# EAGLE design gameboyzero-split-top (EAGLE 8.5.0)
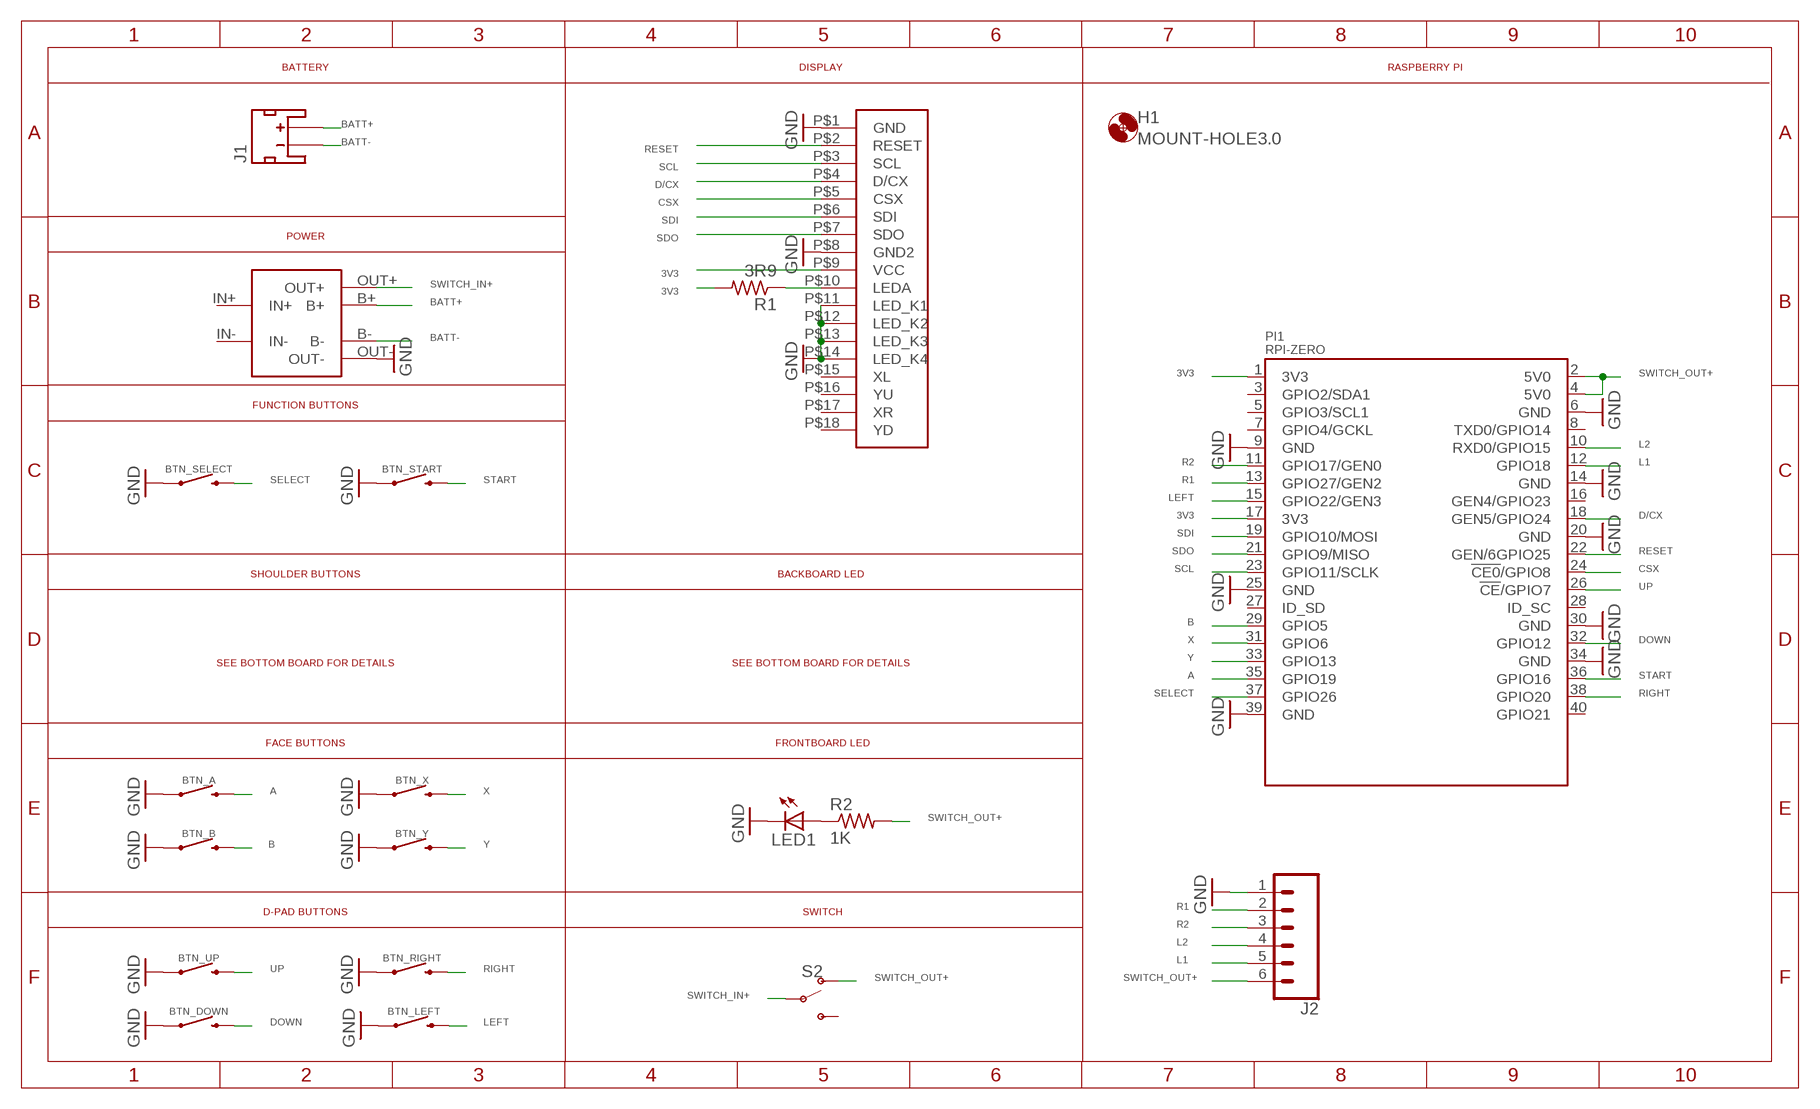
[diagram p0: schematic, sheet 1]

## Parts
BTN_A  MOMENTARY-SWITCH-SPST-SMD-12MM  [TACTILE_SWITCH_SMD_12MM]
BTN_B  MOMENTARY-SWITCH-SPST-SMD-12MM  [TACTILE_SWITCH_SMD_12MM]
BTN_DOWN  MOMENTARY-SWITCH-SPST-SMD-6.2MM-TALL  [TACTILE_SWITCH_SMD_6.2MM_TALL]
BTN_LEFT  MOMENTARY-SWITCH-SPST-SMD-6.2MM-TALL  [TACTILE_SWITCH_SMD_6.2MM_TALL]
BTN_RIGHT  MOMENTARY-SWITCH-SPST-SMD-6.2MM-TALL  [TACTILE_SWITCH_SMD_6.2MM_TALL]
BTN_SELECT  MOMENTARY-SWITCH-SPST-SMD-6.0X3.5MM  [TACTILE_SWITCH_SMD_6.0X3.5MM]
BTN_START  MOMENTARY-SWITCH-SPST-SMD-6.0X3.5MM  [TACTILE_SWITCH_SMD_6.0X3.5MM]
BTN_UP  MOMENTARY-SWITCH-SPST-SMD-6.2MM-TALL  [TACTILE_SWITCH_SMD_6.2MM_TALL]
BTN_X  MOMENTARY-SWITCH-SPST-SMD-12MM  [TACTILE_SWITCH_SMD_12MM]
BTN_Y  MOMENTARY-SWITCH-SPST-SMD-12MM  [TACTILE_SWITCH_SMD_12MM]
H1  MOUNT-HOLE3.0  [3,0]
J1  JST_2MM_MALE  [JST-2-SMD]
J2  CONN_06SILK_FEMALE_PTH  [1X06]
LED1  LEDCHIPLED_0805  [CHIPLED_0805]
PI1  RPI-ZERO  [RASPBERRYPI_BASTELSTUBE_V13_RASPI_BOARD_B+_FULL]
POWER1  03962A  [03962A]
R1  3R9  R-US_R0805  [R0805]
R2  1K  R-US_R0805  [R0805]
S2  SWITCH-SPDT-SMD-RIGHT-ANGLE  [SWITCH_SPST_SMD_A]
SCREEN1  GAMEBOYZEROHANDHELDDISPLAYS-2.8  [GAMEBOYZEROHANDHELDDISPLAYS-2.8]

## Nets
3V3: PI1.1(3V3) PI1.17(3V3) R1.2 SCREEN1.P$9(VCC)
3V3100OHM: R1.1 SCREEN1.P$10(LEDA)
A: BTN_A.3 PI1.35(GPIO19)
B: BTN_B.3 PI1.29(GPIO5)
BATT+: J1.2(+) POWER1.B+
BATT-: J1.1(-) POWER1.B-
CSX: PI1.24(!CE0!/GPIO8) SCREEN1.P$5(CSX)
D/CX: PI1.18(GEN5/GPIO24) SCREEN1.P$4(D/CX)
DOWN: BTN_DOWN.B2 PI1.32(GPIO12)
GND: BTN_A.1 BTN_B.1 BTN_DOWN.A2 BTN_LEFT.A2 BTN_RIGHT.A2 BTN_SELECT.1 BTN_START.1 BTN_UP.A2 BTN_X.1 BTN_Y.1 J2.1 LED1.C PI1.6(GND) PI1.9(GND) PI1.14(GND) PI1.20(GND) PI1.25(GND) PI1.30(GND) PI1.34(GND) PI1.39(GND) POWER1.OUT- SCREEN1.P$1(GND) SCREEN1.P$8(GND2) SCREEN1.P$11(LED_K1) SCREEN1.P$12(LED_K2) SCREEN1.P$13(LED_K3) SCREEN1.P$14(LED_K4)
L1: J2.5 PI1.12(GPIO18)
L2: J2.4 PI1.10(RXD0/GPIO15)
LED: LED1.A R2.1
LEFT: BTN_LEFT.B2 PI1.15(GPIO22/GEN3)
R1: J2.2 PI1.13(GPIO27/GEN2)
R2: J2.3 PI1.11(GPIO17/GEN0)
RESET: PI1.22(GEN/6GPIO25) SCREEN1.P$2(RESET)
RIGHT: BTN_RIGHT.B2 PI1.38(GPIO20)
SCL: PI1.23(GPIO11/SCLK) SCREEN1.P$3(SCL)
SDI: PI1.19(GPIO10/MOSI) SCREEN1.P$6(SDI)
SDO: PI1.21(GPIO9/MISO) SCREEN1.P$7(SDO)
SELECT: BTN_SELECT.2 PI1.37(GPIO26)
START: BTN_START.2 PI1.36(GPIO16)
SWITCH_IN+: POWER1.OUT+ S2.2(P)
SWITCH_OUT+: J2.6 PI1.2(5V0) PI1.4(5V0) R2.2 S2.1(O)
UP: BTN_UP.B2 PI1.26(!CE!/GPIO7)
X: BTN_X.3 PI1.31(GPIO6)
Y: BTN_Y.3 PI1.33(GPIO13)
Unconnected: J1.NC1(PAD1) J1.NC2(PAD2) PI1.3(GPIO2/SDA1) PI1.5(GPIO3/SCL1) PI1.7(GPIO4/GCKL) PI1.8(TXD0/GPIO14) PI1.16(GEN4/GPIO23) PI1.27(ID_SD) PI1.28(ID_SC) PI1.40(GPIO21) POWER1.IN+ POWER1.IN- S2.3(S) SCREEN1.P$15(XL) SCREEN1.P$16(YU) SCREEN1.P$17(XR) SCREEN1.P$18(YD)

## Notes on the sheet
- BATTERY | DISPLAY | RASPBERRY PI
- POWER
- FUNCTION BUTTONS
- SHOULDER BUTTONS | BACKBOARD LED
- SEE BOTTOM BOARD FOR DETAILS | SEE BOTTOM BOARD FOR DETAILS
- FACE BUTTONS | FRONTBOARD LED
- D-PAD BUTTONS | SWITCH

## Library data of the parts
BTN_A BTN_B BTN_X BTN_Y = SparkFun-Switches:MOMENTARY-SWITCH-SPST: Momentary Switch (Pushbutton) - SPST Normally-open (NO) SPST momentary switches (buttons, pushbuttons). Variants PTH-12MM - 12mm square, through-hole Momentary Pushbutton Switch - 12mm Square <https://www.sparkfun.com/products/9190> (COM-09190) PTH-6.0MM, PTH-6.0MM-KIT - 6.0mm square, through-hole Mini Pushbutton Switch <https://www.sparkfun.com/products/97> (COM-00097) KIT package intended for soldering kit's - only one side of pads' copper is exposed. PTH-RIGHT-ANGLE-KIT - Right-angle, through-hole Right Angle Tactile Button <https://www.sparkfun.com/products/10791> - Used on SparkFun BigTime Watch Kit <https://www.sparkfun.com/products/11734> SMD-12MM - 12mm square, surface-mount Tactile Button - SMD (12mm) <https://www.sparkfun.com/products/12993> (COM-12993) Used on SparkFun PicoBoard <https://www.sparkfun.com/products/11888> SMD-4.5MM - 4.5mm Square Trackball Switch Used on SparkFun Blackberry Trackballer Breakout <https://www.sparkfun.com/products/13169> SMD-4.6MMX2.8MM - 4.60mm x 2.80mm, surface mount Used on SparkFun SAMD21 Mini Breakout <https://www.sparkfun.com/products/13664> SMD-5.2MM, SMD-5.2-REDUNDANT - 5.2mm square, surface-mount Mini Pushbutton Switch - SMD <https://www.sparkfun.com/products/8720> (COM-08720) Used on Arduino Pro Mini <https://www.sparkfun.com/products/11114> REDUNDANT package connects both switch circuits together SMD-6.0X3.5MM - 6.0 x 3.5mm, surface mount Momentary Reset Switch SMD <https://www.sparkfun.com/products/8229> (COM-08229) SMD-6.2MM-TALL - 6.2mm square, surface mount Tactile Button - SMD (6mm) <https://www.sparkfun.com/products/12992> Used on SparkFun Digital Sandbox <https://www.sparkfun.com/products/12651> SMD-RIGHT-ANGLE - Right-angle, surface mount Used on SparkFun Block for Intel® Edison - Arduino <https://www.sparkfun.com/products/13036>; PROD_ID: SWCH-11967; SF_SKU: COM-12993
BTN_DOWN BTN_LEFT BTN_RIGHT BTN_UP = SparkFun-Switches:MOMENTARY-SWITCH-SPST: Momentary Switch (Pushbutton) - SPST Normally-open (NO) SPST momentary switches (buttons, pushbuttons). Variants PTH-12MM - 12mm square, through-hole Momentary Pushbutton Switch - 12mm Square <https://www.sparkfun.com/products/9190> (COM-09190) PTH-6.0MM, PTH-6.0MM-KIT - 6.0mm square, through-hole Mini Pushbutton Switch <https://www.sparkfun.com/products/97> (COM-00097) KIT package intended for soldering kit's - only one side of pads' copper is exposed. PTH-RIGHT-ANGLE-KIT - Right-angle, through-hole Right Angle Tactile Button <https://www.sparkfun.com/products/10791> - Used on SparkFun BigTime Watch Kit <https://www.sparkfun.com/products/11734> SMD-12MM - 12mm square, surface-mount Tactile Button - SMD (12mm) <https://www.sparkfun.com/products/12993> (COM-12993) Used on SparkFun PicoBoard <https://www.sparkfun.com/products/11888> SMD-4.5MM - 4.5mm Square Trackball Switch Used on SparkFun Blackberry Trackballer Breakout <https://www.sparkfun.com/products/13169> SMD-4.6MMX2.8MM - 4.60mm x 2.80mm, surface mount Used on SparkFun SAMD21 Mini Breakout <https://www.sparkfun.com/products/13664> SMD-5.2MM, SMD-5.2-REDUNDANT - 5.2mm square, surface-mount Mini Pushbutton Switch - SMD <https://www.sparkfun.com/products/8720> (COM-08720) Used on Arduino Pro Mini <https://www.sparkfun.com/products/11114> REDUNDANT package connects both switch circuits together SMD-6.0X3.5MM - 6.0 x 3.5mm, surface mount Momentary Reset Switch SMD <https://www.sparkfun.com/products/8229> (COM-08229) SMD-6.2MM-TALL - 6.2mm square, surface mount Tactile Button - SMD (6mm) <https://www.sparkfun.com/products/12992> Used on SparkFun Digital Sandbox <https://www.sparkfun.com/products/12651> SMD-RIGHT-ANGLE - Right-angle, surface mount Used on SparkFun Block for Intel® Edison - Arduino <https://www.sparkfun.com/products/13036>; PROD_ID: SWCH-11966; SF_SKU: COM-12992
BTN_SELECT BTN_START = SparkFun-Switches:MOMENTARY-SWITCH-SPST: Momentary Switch (Pushbutton) - SPST Normally-open (NO) SPST momentary switches (buttons, pushbuttons). Variants PTH-12MM - 12mm square, through-hole Momentary Pushbutton Switch - 12mm Square <https://www.sparkfun.com/products/9190> (COM-09190) PTH-6.0MM, PTH-6.0MM-KIT - 6.0mm square, through-hole Mini Pushbutton Switch <https://www.sparkfun.com/products/97> (COM-00097) KIT package intended for soldering kit's - only one side of pads' copper is exposed. PTH-RIGHT-ANGLE-KIT - Right-angle, through-hole Right Angle Tactile Button <https://www.sparkfun.com/products/10791> - Used on SparkFun BigTime Watch Kit <https://www.sparkfun.com/products/11734> SMD-12MM - 12mm square, surface-mount Tactile Button - SMD (12mm) <https://www.sparkfun.com/products/12993> (COM-12993) Used on SparkFun PicoBoard <https://www.sparkfun.com/products/11888> SMD-4.5MM - 4.5mm Square Trackball Switch Used on SparkFun Blackberry Trackballer Breakout <https://www.sparkfun.com/products/13169> SMD-4.6MMX2.8MM - 4.60mm x 2.80mm, surface mount Used on SparkFun SAMD21 Mini Breakout <https://www.sparkfun.com/products/13664> SMD-5.2MM, SMD-5.2-REDUNDANT - 5.2mm square, surface-mount Mini Pushbutton Switch - SMD <https://www.sparkfun.com/products/8720> (COM-08720) Used on Arduino Pro Mini <https://www.sparkfun.com/products/11114> REDUNDANT package connects both switch circuits together SMD-6.0X3.5MM - 6.0 x 3.5mm, surface mount Momentary Reset Switch SMD <https://www.sparkfun.com/products/8229> (COM-08229) SMD-6.2MM-TALL - 6.2mm square, surface mount Tactile Button - SMD (6mm) <https://www.sparkfun.com/products/12992> Used on SparkFun Digital Sandbox <https://www.sparkfun.com/products/12651> SMD-RIGHT-ANGLE - Right-angle, surface mount Used on SparkFun Block for Intel® Edison - Arduino <https://www.sparkfun.com/products/13036>; PROD_ID: SWCH-00815; SF_SKU: COM-08229
H1 = holes:MOUNT-HOLE: MOUNTING HOLE with drill center marker
J1 = SparkFun-Connectors:JST_2MM_MALE: JST 2MM MALE RA CONNECTOR Two pin, compact surface mount connector. Commonly used as a battery input connection point. We really like the solid locking feeling and high current rating on these small connectors. We use these all the time as battery connectors. Mates to single-cell LiPo batteries. Here is the connector we sell at SparkFun: JST Right Angle Connector - White <https://www.sparkfun.com/products/8612> (PRT-08612) Datasheet <http://www.sparkfun.com/datasheets/Prototyping/Connectors/JST-Horizontal.pdf> It was used on these SparkFun products: SparkFun MOSFET Power Controller <https://www.sparkfun.com/products/11214> (PRT-11214) SparkFun Battery Babysitter - LiPo Battery Manager <https://www.sparkfun.com/products/13777> (PRT-13777) And many, many others that required a lipo battery connection.; PROD_ID: CONN-11443; SF_ID: PRT-08612
J2 = SparkFun-Connectors:CONN_06: Multi connection point. Often used as Generic Header-pin footprint for 0.1 inch spaced/style header connections On any of the 0.1 inch spaced packages, you can populate with these: Break Away Headers - Straight <https://www.sparkfun.com/products/116> (PRT-00116) Break Away Male Headers - Right Angle <https://www.sparkfun.com/products/553> (PRT-00553) Female Headers <https://www.sparkfun.com/products/115> (PRT-00115) Break Away Headers - Machine Pin <https://www.sparkfun.com/products/117> (PRT-00117) Break Away Female Headers - Swiss Machine Pin <https://www.sparkfun.com/products/743> (PRT-00743) Arduino Stackable Header - 6 Pin <https://www.sparkfun.com/products/9280> (PRT-09280) For SCREWTERMINALS and SPRING TERMINALS visit here: Screw Terimnals on SparkFun.com <https://www.sparkfun.com/search/results?term=Screw+Terminals> (5mm/3.5mm/2.54mm spacing) This device is also useful as a general connection point to wire up your design to another part of your project. Our various solder wires solder well into these plated through hole pads. Hook-Up Wire - Assortment (Stranded, 22 AWG) <https://www.sparkfun.com/products/11375> (PRT-11375) Hook-Up Wire - Assortment (Solid Core, 22 AWG) <https://www.sparkfun.com/products/11367> (PRT-11367) View the entire wire category on our website here <https://www.sparkfun.com/categories/141>; PROD_ID: CONN-08437
LED1 = adafruit:LED: LED OSRAM: - CHIPLED LG R971, LG N971, LY N971, LG Q971, LY Q971, LO R971, LY R971 LH N974, LH R974 LS Q976, LO Q976, LY Q976 LO Q996 - Hyper CHIPLED LW Q18S LB Q993, LB Q99A, LB R99A - SideLED LS A670, LO A670, LY A670, LG A670, LP A670 LB A673, LV A673, LT A673, LW A673 LH A674 LY A675 LS A676, LA A676, LO A676, LY A676, LW A676 LS A679, LY A679, LG A679 - Hyper Micro SIDELED® LS Y876, LA Y876, LO Y876, LY Y876 LT Y87S - SmartLED LW L88C, LW L88S LB L89C, LB L89S, LG L890 LS L89K, LO L89K, LY L89K LS L896, LA L896, LO L896, LY L896 - TOPLED LS T670, LO T670, LY T670, LG T670, LP T670 LSG T670, LSP T670, LSY T670, LOP T670, LYG T670 LG T671, LOG T671, LSG T671 LB T673, LV T673, LT T673, LW T673 LH T674 LS T676, LA T676, LO T676, LY T676, LB T676, LH T676, LSB T676, LW T676 LB T67C, LV T67C, LT T67C, LS T67K, LO T67K, LY T67K, LW E67C LS E67B, LA E67B, LO E67B, LY E67B, LB E67C, LV E67C, LT E67C LW T67C LS T679, LY T679, LG T679 LS T770, LO T770, LY T770, LG T770, LP T770 LB T773, LV T773, LT T773, LW T773 LH T774 LS E675, LA E675, LY E675, LS T675 LS T776, LA T776, LO T776, LY T776, LB T776 LHGB T686 LT T68C, LB T68C - Hyper Mini TOPLED® LB M676 - Mini TOPLED Santana® LG M470 LS M47K, LO M47K, LY M47K Source: http://www.osram.convergy.de/
PI1 = RPI-Zero:RPI-ZERO
POWER1 = 03962A:03962A
R1 R2 = adafruit:R-US_: RESISTOR, American symbol
S2 = SparkFun-Switches:SWITCH-SPDT: Single Pole, Double Throw (SPDT) Switch Single-pole, double-throw (SPDT) switch. Variant Overview SMD-AYZ0202 Surface Mount DPDT Switch <https://www.sparkfun.com/products/597> (COM-00597) Used on e.g. LilyPad Arduino USB - ATmega32U4 Board <https://www.sparkfun.com/products/12049> PTH-11.6X4.0MM SPDT Mini Power Switch <https://www.sparkfun.com/products/102> (COM-00102) Used on e.g. SparkFun Simon Says - Through-Hole Soldering Kit <https://www.sparkfun.com/products/10547> (KIT-10547) PTH-11.6X4.0MM-KIT KIT version of SPDT Mini Power Switch - Simplifies soldering by removing tStop of switch pins - only one side can be soldered. PTH-11.6X4.0MM-LOCK LOCK version of SPDT Mini Power Switch - Offset pins hold switch in place for easier soldering. SMD-RIGHT-ANGLE Surface Mount Right Angle Switch <https://www.sparkfun.com/products/10860> (COM-10860) Used on e.g. SparkFun ESP8266 Thing <https://www.sparkfun.com/products/13231>; PROD_ID: SWCH-10651; SF_SKU: COM-10860
SCREEN1 = GameboyZeroHandheldDisplays:GAMEBOYZEROHANDHELDDISPLAYS-2.8

## Board
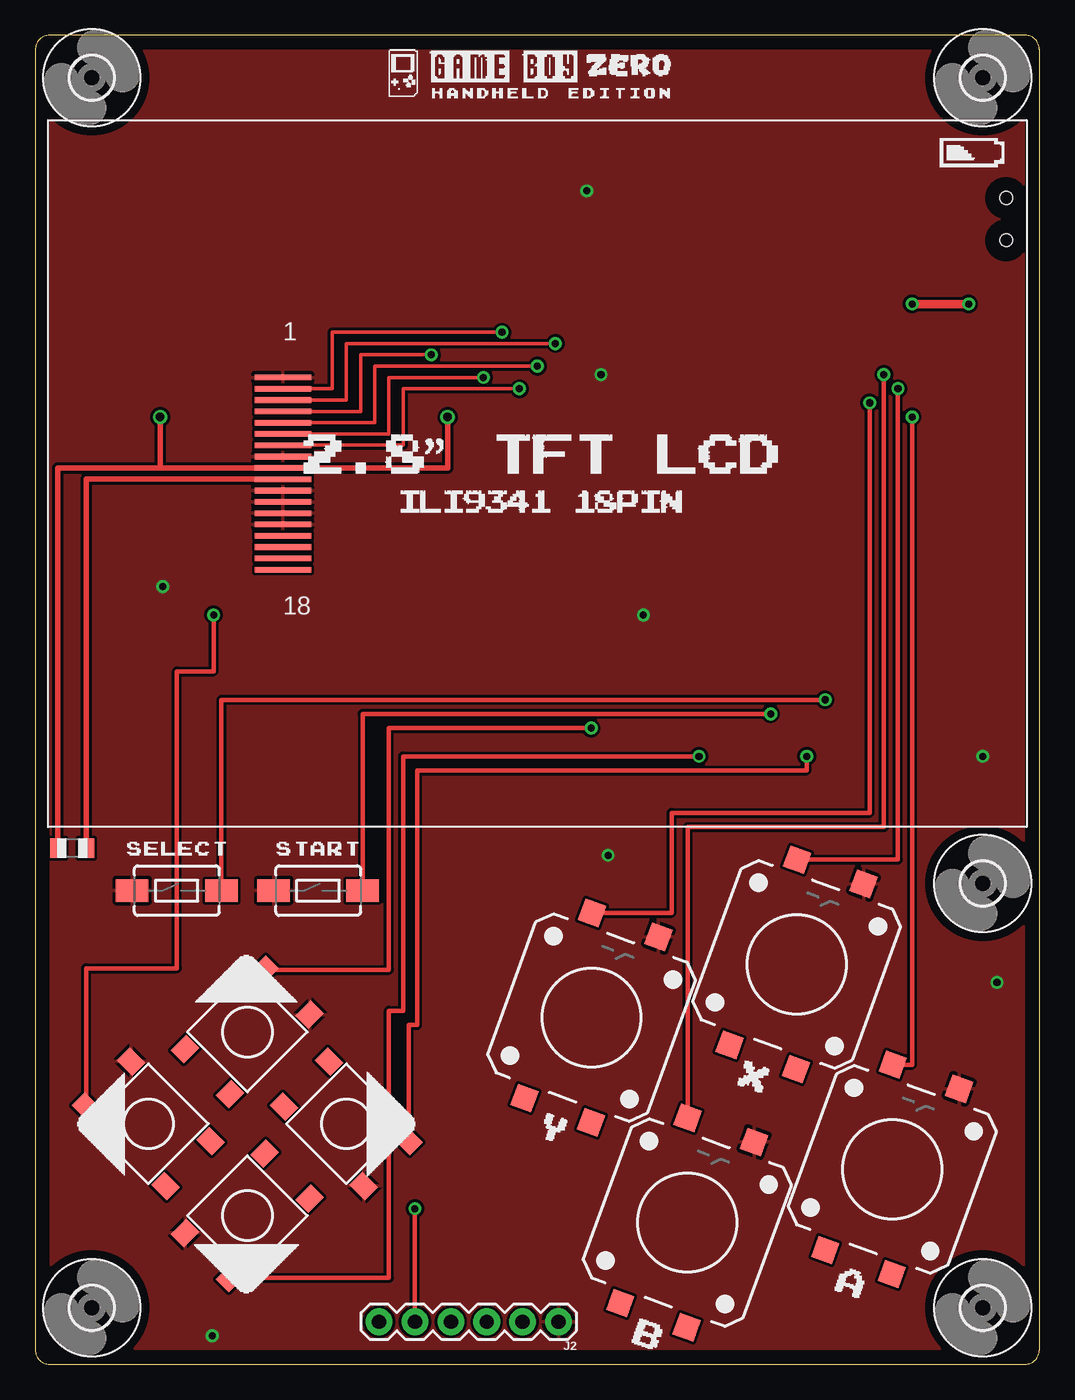
[diagram p1: board, top side]
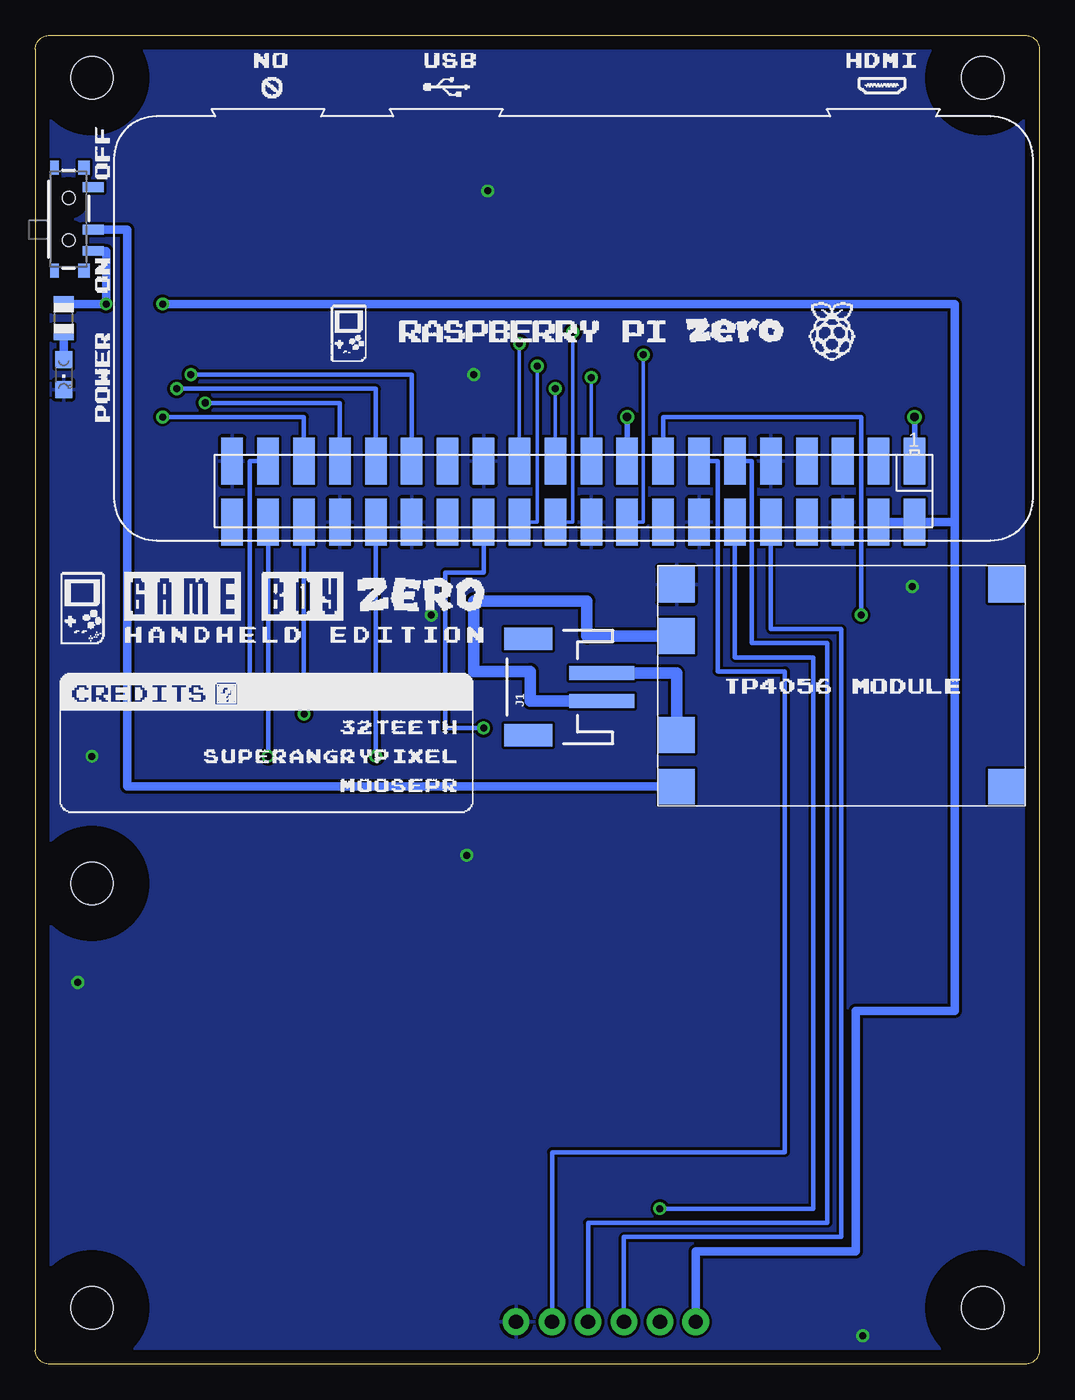
[diagram p2: board, bottom side, seen from below]

Size 71 x 94 mm. Coordinates in mm from the lower left corner, seen from the top.
Outline: 0,93 0,1 arc90 1,0 70,0 arc90 71,1 71,93 arc90 70,94 1,94 arc90 0,93
Copper layers (1*16): Top 0.035mm / dielectric 1.5mm / Bottom 0.035mm
Design rules "default": minimum track width 10mil, minimum drill 24mil, track to track 8mil, track to pad 8mil, pad to pad 8mil, via to via 8mil, smd to smd 8mil, copper to edge 40mil, drill to drill 8mil, minimum pad ring 10mil, minimum via ring 8mil, stop-mask expansion 4mil, vias tented up to drill 0mil, thermal gap 10mil

### Footprints (pad centres in the part's own frame; a part is rotated, then mirrored left to right if it is on the bottom)
TACTILE_SWITCH_SMD_12MM = smd 1.6 x 1.55: 1 6.975,-2.5; 2 -6.975,-2.5; 3 6.975,2.5; 4 -6.975,2.5
TACTILE_SWITCH_SMD_6.2MM_TALL = smd 1.55 x 1.3: A1 -3.975,-2.25; A2 3.975,-2.25; B1 -3.975,2.25; B2 3.975,2.25
TACTILE_SWITCH_SMD_6.0X3.5MM = smd 2.3 x 1.6: 1 -3.15,0; 2 3.15,0
3,0 = hole 3: 0,0
JST-2-SMD = smd 1 x 4.6: 1 -1,-3.7; 2 1,-3.7 | smd 1.6 x 3.4: NC1 -3.4,1.5; NC2 3.4,1.5
1X06 = drill 1.016 pad 1.88: 1 0,0; 2 2.54,0; 3 5.08,0; 4 7.62,0; 5 10.16,0; 6 12.7,0
CHIPLED_0805 = smd 1.2 x 1.2: A 0,-1.05; C 0,1.05
RASPBERRYPI_BASTELSTUBE_V13_RASPI_BOARD_B+_FULL = smd 1.524 x 3.302: 1 8.382,24.384; 2 8.382,28.702; 3 10.922,24.384; 4 10.922,28.702; 5 13.462,24.384; 6 13.462,28.702; 7 16.002,24.384; 8 16.002,28.702; 9 18.542,24.384; 10 18.542,28.702; 11 21.082,24.384; 12 21.082,28.702; 13 23.622,24.384; 14 23.622,28.702; 15 26.162,24.384; 16 26.162,28.702; 17 28.702,24.384; 18 28.702,28.702; 19 31.242,24.384; 20 31.242,28.702; 21 33.782,24.384; 22 33.782,28.702; 23 36.322,24.384; 24 36.322,28.702; 25 38.862,24.384; 26 38.862,28.702; 27 41.402,24.384; 28 41.402,28.702; 29 43.942,24.384; 30 43.942,28.702; 31 46.482,24.384; 32 46.482,28.702; 33 49.022,24.384; 34 49.022,28.702; 35 51.562,24.384; 36 51.562,28.702; 37 54.102,24.384; 38 54.102,28.702; 39 56.642,24.384; 40 56.642,28.702
03962A = smd 2.54 x 2.54: B+ 12,1.35; B- 5,1.35; IN+ 15.65,24.65; IN- 1.35,24.65; OUT+ 15.65,1.35; OUT- 1.35,1.35
R0805 = smd 1.1 x 1.4: 1 -1,0; 2 1,0
SWITCH_SPST_SMD_A = smd 0.7 x 1.5: 1 -2.25,-1.75; 2 -0.75,-1.75; 3 2.25,-1.75 | smd 1 x 0.6: GND1 -3.65,1; GND3 3.65,1 | smd 1 x 0.8: GND2 -3.65,-1.1; GND4 3.65,-1.1 | hole 0.9: -1.5,0; 1.5,0
GAMEBOYZEROHANDHELDDISPLAYS-2.8 = smd 4 x 0.4: P$1 -18,6.8; P$2 -18,6; P$3 -18,5.2; P$4 -18,4.4; P$5 -18,3.6; P$6 -18,2.8; P$7 -18,2; P$8 -18,1.2; P$9 -18,0.4; P$10 -18,-0.4; P$11 -18,-1.2; P$12 -18,-2; P$13 -18,-2.8; P$14 -18,-3.6; P$15 -18,-4.4; P$16 -18,-5.2; P$17 -18,-6; P$18 -18,-6.8

### Placement (x,y rotation side)
BTN_A  60.59,13.78 70 top
BTN_B  46.09,10.02 70 top
BTN_DOWN  15,10.5 225 top
BTN_LEFT  8,17 135 top
BTN_RIGHT  22,17 315 top
BTN_SELECT  10,33.5 0 top
BTN_START  20,33.5 0 top
BTN_UP  15,23.5 45 top
BTN_X  53.83,28.28 70 top
BTN_Y  39.33,24.52 70 top
H1  4,4 0 top
H2  MOUNT-HOLE2.8  [3,0]  67,4 0 top
H3  MOUNT-HOLE2.8  [3,0]  67,34 0 top
H4  MOUNT-HOLE2.8  [3,0]  4,91 0 top
H5  MOUNT-HOLE2.8  [3,0]  67,91 0 top
J1  34.65,47.9 90 bottom
J2  37,3 180 top
LED1  69,70 180 bottom
PI1  0.45,88.27 180 bottom
POWER1  27,56.5 270 bottom
R1  2.6,36.5 180 top
R2  69,74 90 bottom
S2  68.65,81 90 bottom
SCREEN1  35.5,63 0 top

### Tracks (layer width: path | path; a pad name or v marks a point on that pad's centre or on a via)
3V3  (via drill 0.6)
  Top 0.406: R1.2 1.6,63.4 8.83,63.4 | 8.83,63.4 v8.83,67 | v29.15,67 29.15,63.4 SCREEN1.P$9 8.83,63.4
  Bottom 0.406: v8.83,67 8.83,64.65 PI1.1 | v29.15,67 29.15,64.65 PI1.17
3V3100OHM
  Top 0.406: R1.1 3.6,62.6 SCREEN1.P$10
A  (via drill 0.5)
  Top 0.305: BTN_A.3 62,21.19 v62,67
  Bottom 0.254: 52.01,64.65 PI1.35
  Bottom 0.305: PI1.35 52.01,67 v62,67
B  (via drill 0.5)
  Top 0.305: BTN_B.3 46.13,38 60,38 v60,70
  Bottom 0.254: 44.39,64.65 44.39,63
  Bottom 0.305: 44.39,63 PI1.29 44.39,70 v60,70
BATT+
  Bottom 0.813: POWER1.B+ 25.65,48.9 J1.2
BATT-
  Bottom 0.813: POWER1.B- 32,51.5 32,54 40,54 40,49 36,49 36,46.9 J1.1
CSX  (via drill 0.5)
  Top 0.254: v35.5,70.6 24,70.6 24,66.6 SCREEN1.P$5
  Bottom 0.254: v35.5,70.6 35.5,59.57 PI1.24 36.77,58.81
D/CX  (via drill 0.5)
  Top 0.254: v28,71.4 23,71.4 23,67.4 SCREEN1.P$4
  Bottom 0.254: v28,71.4 28,59.57 PI1.18 29.15,58.81
DOWN  (via drill 0.5)
  Top 0.305: BTN_DOWN.B2 25,6.1 25,25 26,25 26,43 v46.93,43
  Bottom 0.254: PI1.32 46.93,59
  Bottom 0.305: 46.93,59 v46.93,43
  Bottom 0.406: 46.93,58.81 46.93,59
GND  (via drill 0.5)
  other vias: 9,55 39,83 40,70 43,53 67,43 12.5,2 68,27 40.5,36
  pour Bottom: 0,0 0,94 71,94 71,0
  pour Top: 71,94 71,0 0,0 0,94
L1  (via drill 0.5)
  Top 0.305: J2.5 v26.84,11
  Bottom 0.305: PI1.12 21.53,50 16,50 16,11 v26.84,11
L2
  Bottom 0.305: 18.99,58.81 18.99,52 14,52 14,9 29.38,9 J2.4
  Bottom 0.406: PI1.10 18.99,58.81
LED
  Bottom 0.61: LED1.A R2.1
LEFT  (via drill 0.5)
  Top 0.305: BTN_LEFT.B2 3.6,28 10,28 10,49 12.6,49 v12.6,53
  Bottom 0.305: v12.6,53 12.6,67 26.61,67 26.61,64.65 PI1.15
R1
  Bottom 0.254: 24.07,64.65 PI1.13
  Bottom 0.305: PI1.13 22.75,63.89 22.75,49 18,49 18,15 34.46,15 J2.2
R2
  Bottom 0.254: 21.53,64.65 PI1.11
  Bottom 0.305: PI1.11 20.35,63.89 20.35,51 15,51 15,10 31.92,10 J2.3
RESET  (via drill 0.5)
  Top 0.254: v33,73 21,73 21,69 SCREEN1.P$2
  Bottom 0.254: v33,73 33,59.57 PI1.22 34.23,58.81
RIGHT  (via drill 0.5)
  Top 0.305: BTN_RIGHT.B2 26.4,24 27,24 27,42 54.55,42 v54.55,43
  Bottom 0.254: PI1.38 54.55,59
  Bottom 0.305: 54.55,59 v54.55,43
  Bottom 0.406: 54.55,58.81 54.55,59
SCL  (via drill 0.5)
  Top 0.254: SCREEN1.P$3 22,68.2 22,72.2 v36.77,72.2
  Bottom 0.254: 36.77,63 PI1.23 | 36.77,63 v36.77,72.2 | 36.77,64.65 36.77,63
SDI  (via drill 0.5)
  Top 0.254: SCREEN1.P$6 25,65.8 25,69.8 v31.69,69.8
  Bottom 0.254: v31.69,69.8 31.69,64.65 PI1.19
SDO  (via drill 0.5)
  Top 0.254: SCREEN1.P$7 26,65 26,69 v34.23,69
  Bottom 0.254: v34.23,69 34.23,64.65 PI1.21
SELECT  (via drill 0.5)
  Top 0.305: BTN_SELECT.2 13.15,47 v55.85,47
  Bottom 0.254: 54.55,64.65 PI1.37
  Bottom 0.305: PI1.37 55.85,63.89 v55.85,47
START  (via drill 0.5)
  Top 0.305: BTN_START.2 23.15,46 v52,46
  Bottom 0.254: PI1.36 52.01,59
  Bottom 0.305: 52.01,59 v52.01,46 v52,46
  Bottom 0.406: 52.01,58.81 52.01,59
SWITCH_IN+
  Bottom 0.61: S2.2 64.5,80.25 64.5,40.85 POWER1.OUT+
SWITCH_OUT+  (via drill 0.5)
  Top 0.61: v62,75 v66,75
  Bottom 0.254: PI1.4 11.37,58.81 | PI1.2 8.83,58.81
  Bottom 0.61: R2.2 v66,75 66,78.75 S2.1 | PI1.4 PI1.2 6,59.57 | 6,59.57 6,75 v62,75 | 6,59.57 6,25 13,25 13,8 24.3,8 J2.6
UP  (via drill 0.5)
  Top 0.305: BTN_UP.B2 25,27.9 25,45 v39.31,45
  Bottom 0.254: PI1.26 39.31,59
  Bottom 0.305: 39.31,58.81 39.31,56 42,56 42,45 v39.31,45
  Bottom 0.406: 39.31,59 39.31,58.81
X  (via drill 0.5)
  Top 0.305: BTN_X.3 61,35.69 v61,69
  Bottom 0.254: 46.93,64.65 PI1.31
  Bottom 0.305: PI1.31 46.93,69 v61,69
Y  (via drill 0.5)
  Top 0.305: v59,68 59,39 45,39 45,31.93 BTN_Y.3
  Bottom 0.254: 49.47,64.65 49.47,63
  Bottom 0.305: 49.47,63 PI1.33 49.47,68 v59,68